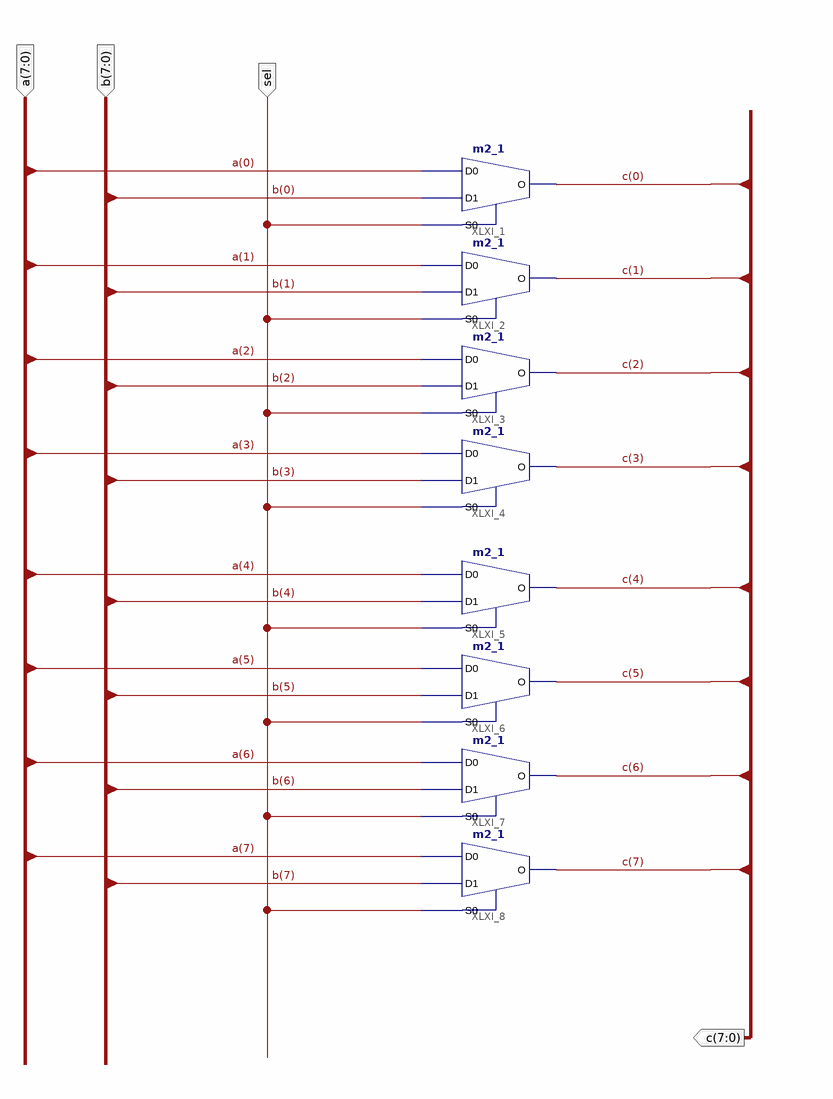
[diagram p0: schematic sheet 1]
// Xilinx ISE schematic mux2x8.sch (spartan6) as structural Verilog: 8 symbols, 4 ports
module mux2x8 (
  input  [7:0] a,
  input  [7:0] b,
  input  sel,
  output [7:0] c
);

  m2_1 XLXI_1 (.D0(a[0]), .D1(b[0]), .S0(sel), .O(c[0]));
  m2_1 XLXI_2 (.D0(a[1]), .D1(b[1]), .S0(sel), .O(c[1]));
  m2_1 XLXI_3 (.D0(a[2]), .D1(b[2]), .S0(sel), .O(c[2]));
  m2_1 XLXI_4 (.D0(a[3]), .D1(b[3]), .S0(sel), .O(c[3]));
  m2_1 XLXI_5 (.D0(a[4]), .D1(b[4]), .S0(sel), .O(c[4]));
  m2_1 XLXI_6 (.D0(a[5]), .D1(b[5]), .S0(sel), .O(c[5]));
  m2_1 XLXI_7 (.D0(a[6]), .D1(b[6]), .S0(sel), .O(c[6]));
  m2_1 XLXI_8 (.D0(a[7]), .D1(b[7]), .S0(sel), .O(c[7]));
endmodule
